# Altium project Si24r1遥控.PrjPcb
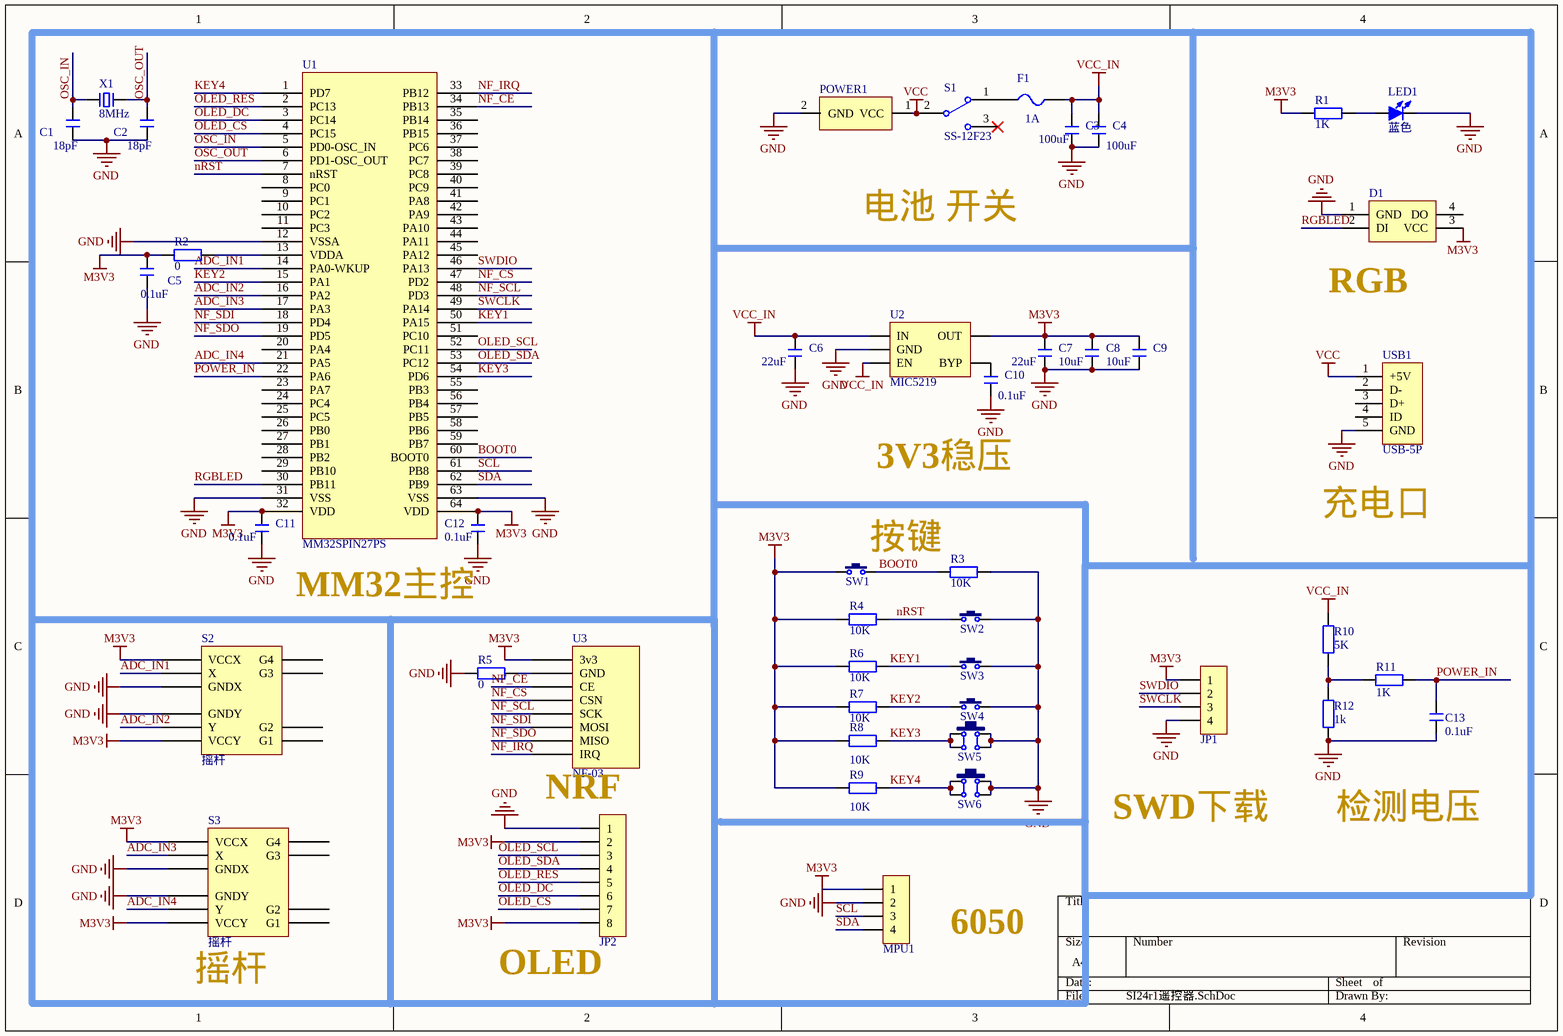
[diagram p0: SI24r1遥控器.SchDoc]
1 sheet, 46 parts. Net scope: global (net labels, ports and power ports of the same name join across sheets).
Board file: SI24R1遥控器.PcbDoc

## Sheet SI24r1遥控器.SchDoc: EnmaAi
size A4; Date: 2021/3/19; Author: EnmaAI; Revision: 1.0

### Parts
C1  18pF  [C 0805_M]
C2  18pF  [C 0805_M]
C3  100uF  [C 0805_M]
C4  100uF  [C 0805_M]
C5  0.1uF  [C 0805_M]
C6  22uF  [C 0805_M]
C7  22uF  [C 0805_M]
C8  10uF  [C 0805_M]
C9  10uF  [C 0805_M]
C10  0.1uF  [C 0805_M]
C11  0.1uF  [C 0805_M]
C12  0.1uF  [C 0805_M]
C13  0.1uF  [C 0805_M]
D1  P923D  [RGB_LED_5050]  (value not drawn)
F1  1A  [FU 0805]
JP1  HDR-1X4  [XH2.54-WI-4P]  (value not drawn)
JP2  HDR-1X8  [IPS]  (value not drawn)
LED1  蓝色  [LED 0805B]
MPU1  HDR-1X4  [HDR2.54-LI-4P]  (value not drawn)
POWER1  (no value)  [XH2.54-LI-2P]
R1  value 1K  [R 0805_M]  (hidden comment: Res2)
R2  0  [R 0805_M]
R3  10K  [R 0805_M]
R4  10K  [R 0805_M]
R5  0  [R 0805_M]
R6  10K  [R 0805_M]
R7  10K  [R 0805_M]
R8  10K  [R 0805_M]
R9  10K  [R 0805_M]
R10  value 5K  [R 0805_M]  (hidden comment: Res2)
R11  value 1K  [R 0805_M]  (hidden comment: Res2)
R12  value 1k  [R 0805_M]  (hidden comment: Res2)
S1  SS-12F23  [SS-12D10]
S2  摇杆  [3D161摇杆]
S3  摇杆  [3D161摇杆]
SW1  3x6x5  [TSW SMD-3*6*2.5]  (value not drawn)
SW2  3x6x5  [TSW SMD-3*6*2.5]  (value not drawn)
SW3  6x6x5  [TSW DIP-6*6*7_V]  (value not drawn)
SW4  6x6x5  [TSW DIP-6*6*7_V]  (value not drawn)
SW5  6x6x5  [TSW DIP-6*6*6]  (value not drawn)
SW6  6x6x5  [TSW DIP-6*6*6]  (value not drawn)
U1  MM32SPIN27PS  [LQFP64 10x10_M]
U2  MIC5219  [SOT23-5M]
U3  NF-03  [NF-03]
USB1  USB-5P  [USB-MICRO_A]
X1  8MHz  [OSC 5032-2P]

### Nets
GND: C1.1 C2.1 C3.1 C4.1 C5.1 C6.1 C7.1 C8.1 C9.1 C10.1 C11.1 C12.1 C13.1 D1.1(GND) JP1.4 JP2.1 LED1.2(K) MPU1.2 POWER1.2(GND) R3.2 R5.2 R12.1 S2.3(GNDX) S2.4(GNDY) S3.3(GNDX) S3.4(GNDY) SW2.2 SW3.2 SW4.2 SW5.2 SW5.3 SW6.2 SW6.3 U1.12(VSSA) U1.31(VSS) U1.63(VSS) U2.2(GND) USB1.5(GND)
M3V3: C5.2 C7.2 C8.2 C9.2 C11.2 C12.2 D1.3(VCC) JP1.1 JP2.2 JP2.8 MPU1.1 R1.2 R2.2 R4.1 R6.1 R7.1 R8.1 R9.1 S2.1(VCCX) S2.6(VCCY) S3.1(VCCX) S3.6(VCCY) SW1.1 U1.32(VDD) U1.64(VDD) U2.5(OUT) U3.1(3v3)
VCC: POWER1.1(VCC) S1.2 USB1.1(+5V)
VCC_IN: C3.2 C4.2 C6.2 F1.2 R10.2 U2.1(IN) U2.3(EN)
ADC_IN1: S2.2(X) U1.14(PA0-WKUP)
ADC_IN2: S2.5(Y) U1.16(PA2)
ADC_IN3: S3.2(X) U1.17(PA3)
ADC_IN4: S3.5(Y) U1.21(PA5)
BOOT0: R3.1 SW1.2 U1.60(BOOT0)
KEY1: R6.2 SW3.1 U1.50(PA15)
KEY2: R7.2 SW4.1 U1.15(PA1)
KEY3: R8.2 SW5.1 SW5.4 U1.54(PD6)
KEY4: R9.2 SW6.1 SW6.4 U1.1(PD7)
NF_CE: U1.34(PB13) U3.3(CE)
NF_CS: U1.47(PD2) U3.4(CSN)
NF_IRQ: U1.33(PB12) U3.8(IRQ)
NF_SCL: U1.48(PD3) U3.5(SCK)
NF_SDI: U1.18(PD4) U3.6(MOSI)
NF_SDO: U1.19(PD5) U3.7(MISO)
nRST: R4.2 SW2.1 U1.7(nRST)
OLED_CS: JP2.7 U1.4(PC15)
OLED_DC: JP2.6 U1.3(PC14)
OLED_RES: JP2.5 U1.2(PC13)
OLED_SCL: JP2.3 U1.52(PC11)
OLED_SDA: JP2.4 U1.53(PC12)
OSC_IN: C1.2 U1.5(PD0-OSC_IN) X1.1
OSC_OUT: C2.2 U1.6(PD1-OSC_OUT) X1.2
POWER_IN: C13.2 R11.1 U1.22(PA6)
RGBLED: D1.2(DI) U1.30(PB11)
SCL: MPU1.3 U1.61(PB8)
SDA: MPU1.4 U1.62(PB9)
SWCLK: JP1.3 U1.49(PA14)
SWDIO: JP1.2 U1.46(PA13)
NetC10_2: C10.2 U2.4(BYP)
NetF1_1: F1.1 S1.1
NetLED1_1: LED1.1(A) R1.1
NetR2_1: R2.1 U1.13(VDDA)
NetR5_1: R5.1 U3.2(GND)
NetR10_1: R10.1 R11.2 R12.2

Not connected (* = marked no-connect by the designer): D1 4(DO); S1 3*; S2 7(G1) 8(G2) 9(G3) 10(G4); S3 7(G1) 8(G2) 9(G3) 10(G4); U1 8(PC0) 9(PC1) 10(PC2) 11(PC3) 20(PA4) 23(PA7) 24(PC4) 25(PC5) 26(PB0) 27(PB1) 28(PB2) 29(PB10) 35(PB14) 36(PB15) 37(PC6) 38(PC7) 39(PC8) 40(PC9) 41(PA8) 42(PA9) 43(PA10) 44(PA11) 45(PA12) 51(PC10) 55(PB3) 56(PB4) 57(PB5) 58(PB6) 59(PB7); USB1 2(D-) 3(D+) 4(ID)

### Notes on the sheet
- 电池 开关
- (near D1) RGB
- 3V3稳压
- 充电口
- (near SW1) 按键
- MM32主控
- NRF
- SWD下载
- 检测电压
- (near S3) 摇杆
- (near JP2) OLED
- 6050

### Library data of the parts
C1-C13 = C: 贴片电容; BOM名称: 无极性贴片电容; 淘宝ID: 封装库来自淘宝 ID：黄晶宝石; 联系售后: https://shop463601444.taobao.com
F1 = FU: 贴片保险丝; 版权归属: 源创客; BOM名称: 贴片保险丝; 学习资源: www.ooocke.com
JP1 MPU1 = Header 4: 4P接插件; 版权归属: 封装库来自淘宝 ID：黄晶宝石; BOM名称: 4P接插件; 学习资源: https://shop463601444.taobao.com
JP2 = Header 8: 8P接插件; 版权归属: 封装库来自淘宝 ID：黄晶宝石; BOM名称: 8P接插件; 学习资源: https://shop463601444.taobao.com
LED1 = LED-SMD: 贴片LED; 版权归属: 封装库来自淘宝 ID：黄晶宝石; BOM名称: 贴片LED; 学习资源: https://shop463601444.taobao.com
POWER1 = T槽
R1 R10-R12 = Res2: Resistor; Published: 8-Jun-2000; LatestRevisionDate: 17-Jul-2002; LatestRevisionNote: Re-released for DXP Platform.; PackageReference: AXIAL-0.4; Publisher: Altium Limited; PackageDescription: Axial Device, Thru-Hole; 2 Leads; 0.4 in Pin Spacing
R2-R9 = RES
S1 = SSW-1P: 1路波动开关; BOM名称: 波动开关; 版权归属: 封装库来自淘宝 ID：黄晶宝石; 学习资源: www.ooocke.com
SW1 SW2 = TSW 3x6: 3x6轻触开关; 版权归属: 封装库来自淘宝 ID：黄晶宝石; BOM名称: 3x6轻触开关; 学习资源: www.ooocke.com
SW3 SW4 = TSW DIP-6x6_V: 侧按直插6x6轻触开关; 版权归属: 封装库来自淘宝 ID：黄晶宝石; BOM名称: 直插6x6轻触开关; 学习资源: https://shop463601444.taobao.com
SW5 SW6 = TSW DIP-6x6: 直插6x6轻触开关; 版权归属: 封装库来自淘宝 ID：黄晶宝石; BOM名称: 直插6x6轻触开关; 学习资源: https://shop463601444.taobao.com
USB1 = USB-5P: 微型USB母座; BOM名称: 微型USB母座; 学习资源: https://shop463601444.taobao.com
X1 = XTAL-2P: 2脚无源脚晶振; 版权归属: 源创客; BOM名称: 2脚无源脚晶振; 学习资源: www.ooocke.com
D1 = P923D: Publisher: mazhongwei; Published: 8-August-2017; PackageReference: RGB_LED_5050